# Altium schematic sheet Single_Amplifier(Filter)2.0.SchDoc
size A2; Organization: Altium Limited; Address1: L3, 12a Rodborough Rd; Address2: Frenchs Forest; Address3: NSW; Address4: Australia 2086
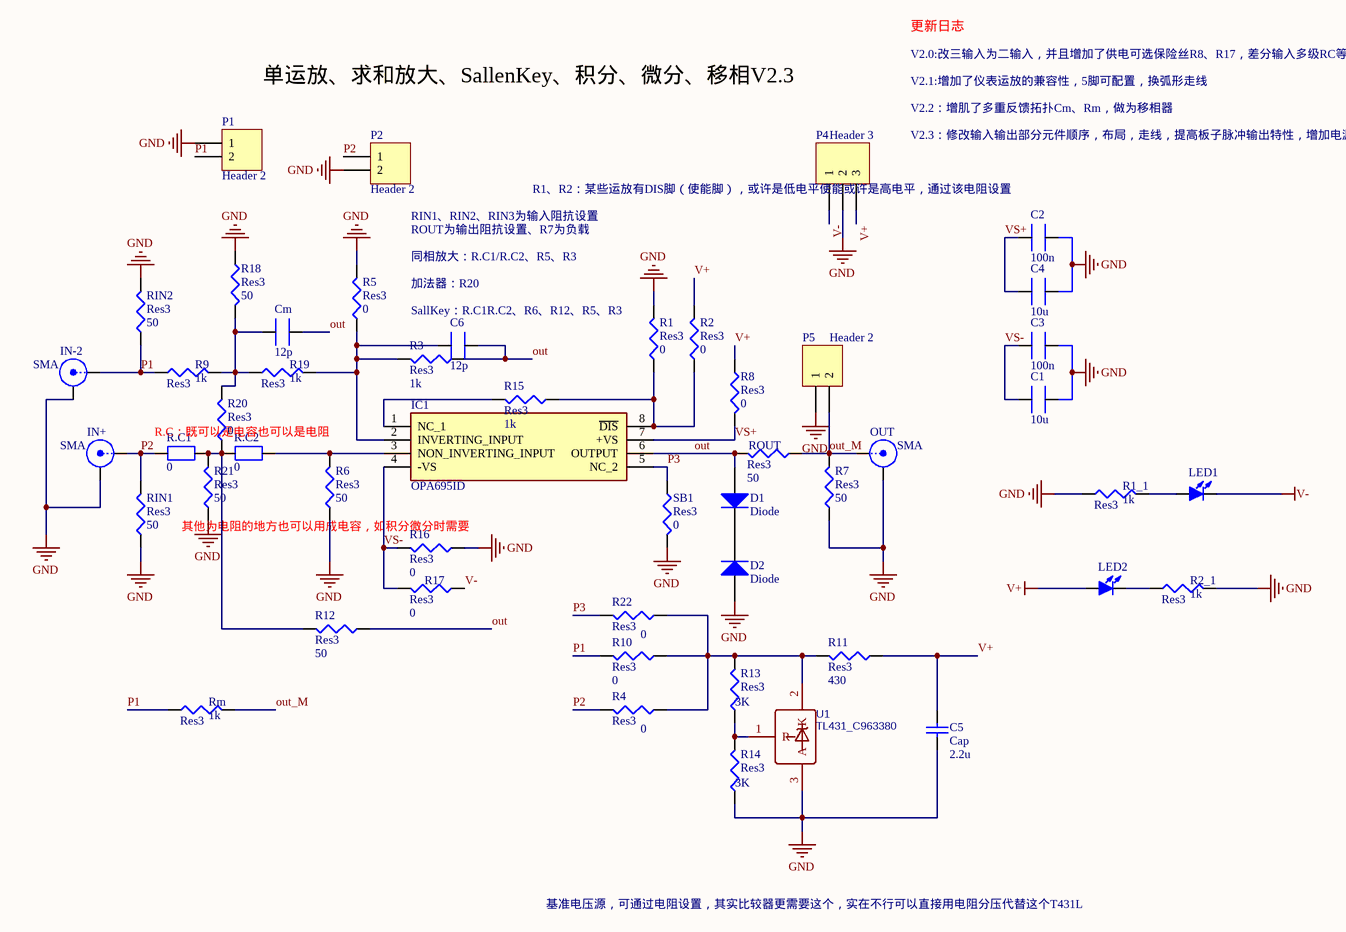
[diagram p0: Single_Amplifier(Filter)2.0.SchDoc]

## Parts
C1  10u  [0805D]
C2  100n  [0805D]
C3  100n  [0805D]
C4  10u  [0805D]
C5  Cap  value 2.2u  [0805D]
C6  12p  [0805D]
Cm  12p  [0805D]
D1  Diode  [1206A]
D2  Diode  [1206A]
IC1  OPA695ID  [SOIC127P600X175-8N]
IN+  SMA  [SMA1]
IN-2  SMA  [SMA1]
LED1  (no value)  [0805D]
LED2  (no value)  [0805D]
OUT  SMA  [SMA1]
P1  Header 2  [HDR1X2]
P2  Header 2  [HDR1X2]
P4  Header 3  [HDR1X3]
P5  Header 2  [HDR1X2]
R1  Res3  value 0  [0805D]
R1_1  Res3  value 1k  [0805D]
R2  Res3  value 0  [0805D]
R2_1  Res3  value 1k  [0805D]
R3  Res3  value 1k  [0805D]
R4  Res3  value 0  [0805D]
R5  Res3  value 0  [0805D]
R6  Res3  value 50  [0805D]
R7  Res3  value 50  [0805D]
R8  Res3  value 0  [0805D]
R9  Res3  value 1k  [0805D]
R10  Res3  value 0  [0805D]
R11  Res3  value 430  [0805D]
R12  Res3  value 50  [0805D]
R13  Res3  value 3K  [0805D]
R14  Res3  value 3K  [0805D]
R15  Res3  value 1k  [0805D]
R16  Res3  value 0  [0805D]
R17  Res3  value 0  [0805D]
R18  Res3  value 50  [0805D]
R19  Res3  value 1k  [0805D]
R20  Res3  value 0  [0805D]
R21  Res3  value 50  [0805D]
R22  Res3  value 0  [0805D]
R.C1  0  [0805D]
R.C2  0  [0805D]
RIN1  Res3  value 50  [0805D]
RIN2  Res3  value 50  [0805D]
Rm  Res3  value 1k  [0805D]
ROUT  Res3  value 50  [0805D]
SB1  Res3  value 0  [0805D]
U1  TL431_C963380  [SOT-23]

## Nets
GND: C1.2(SD) C2.2(SD) C3.2(SD) C4.2(SD) C5.1 D2.1(A) IN+.2(Y) IN-2.2(Y) OUT.2(Y) P1.1 P2.2 P4.2 P5.1 R1.2 R1_1.1 R2_1.2 R5.2 R6.1 R7.1 R14.1 R16.1 R18.1 R21.1 RIN1.1 RIN2.2 SB1.2 U1.3(A)
V+: C5.2 LED2.1(A) P4.3 R2.2 R8.1 R11.1
V-: LED1.2(K) P4.1 R17.1
out: C6.2(SD) Cm.2(SD) D1.1(A) IC1.6(OUTPUT) R3.1 R12.1 ROUT.2
out_M: OUT.1(X) P5.2 R7.2 Rm.2 ROUT.1
P1: IN-2.1(X) P1.2 R9.1 R10.2 RIN2.1 Rm.1
P2: IN+.1(X) P2.1 R4.2 R.C1.1(SD) RIN1.2
P3: IC1.5(NC_2) R22.2 SB1.1
VS+: C2.1(SD) C4.1(SD) IC1.7(+VS) R8.2
VS-: C1.1(SD) C3.1(SD) IC1.4(-VS) R16.2 R17.2
NetC6_1: C6.1(SD) IC1.2(INVERTING_INPUT) R3.2 R5.1 R19.2
NetCm_1: Cm.1(SD) R9.2 R18.2 R19.1 R20.2
NetD1_2: D1.2(K) D2.2(K)
NetIC1_1: IC1.1(NC_1) R15.2
NetIC1_3: IC1.3(NON_INVERTING_INPUT) R6.2 R.C2.2(SD)
NetIC1_8: IC1.8(~{DIS}) R1.1 R2.1 R15.1
NetLED1_1: LED1.1(A) R1_1.2
NetLED2_2: LED2.2(K) R2_1.1
NetR4_1: R4.1 R10.1 R11.2 R13.2 R22.1 U1.2(K)
NetR12_2: R12.2 R20.1 R21.2 R.C1.2(SD) R.C2.1(SD)
NetR13_1: R13.1 R14.2 U1.1(R)

## Notes on the sheet
- V2.0:改三输入为二输入，并且增加了供电可选保险丝R8、R17，差分输入多级RC等
- 更新日志
- 单运放、求和放大、SallenKey、积分、微分、移相V2.3
- V2.1:增加了仪表运放的兼容性，5脚可配置，换弧形走线
- V2.2：增肌了多重反馈拓扑Cm、Rm，做为移相器
- (near P4) R1、R2：某些运放有DIS脚（使能脚），或许是低电平使能或许是高电平，通过该电阻设置
- V2.3：修改输入输出部分元件顺序，布局，走线，提高板子脉冲输出特性，增加电源指示灯
- RIN1、RIN2、RIN3为输入阻抗设置
- 同相放大：R.C1/R.C2、R5、R3
- ROUT为输出阻抗设置、R7为负载
- SallKey：R.C1R.C2、R6、R12、R5、R3
- 加法器：R20
- (near R20) R.C：既可以是电容也可以是电阻
- 其他为电阻的地方也可以用成电容，如积分微分时需要
- 基准电压源，可通过电阻设置，其实比较器更需要这个，实在不行可以直接用电阻分压代替这个T431L
- Title
- Size:
- Date:
- File:
- A2
- Number:
- Time:
- Revision:
- Sheet
- of

## Library data of the parts
C1-C4 C6 Cm = CAP_T
C5 = Cap: Capacitor; Published: 8-Jun-2000; LatestRevisionDate: 17-Jul-2002; LatestRevisionNote: Re-released for DXP Platform.; PackageReference: RAD-0.3; Publisher: Altium Limited; PackageDescription: Radial Cap, Thru-Hole; 2 Leads; 0.3 in Pin Spacing
D1 D2 = Diode: Default Diode; Published: 8-Jun-2000; LatestRevisionDate: 17-Jul-2002; LatestRevisionNote: Re-released for DXP Platform.; PackageVersion: Sep-1996; PackageReference: SMC; Publisher: Altium Limited; PackageDescription: DO-214-AB/SMC; 2 C-Bend Leads; Body 7.9 x 5.9 mm, inc. leads (LxW); Code_JEDEC: DO-214-AB
IC1 = OPA695ID: Integrated Circuit; Manufacturer_Name: Texas Instruments; Datasheet Link: http://www.ti.com/lit/ds/symlink/opa695.pdf; Height: 1.75mm; Manufacturer_Part_Number: OPA695ID; Mouser Part Number: 595-OPA695ID; Mouser Price/Stock: https://www.mouser.co.uk/ProductDetail/Texas-Instruments/OPA695ID/?qs=wgAEGBTxy7n%252BTWPkkfsFRg%3D%3D; Arrow Part Number: OPA695ID; Arrow Price/Stock: https://www.arrow.com/en/products/opa695id/texas-instruments
IN+ IN-2 OUT = BNC: BNC Elbow Connector; LatestRevisionDate: 17-Jul-2002; LatestRevisionNote: Re-released for DXP Platform.; Publisher: Altium Limited
LED1 LED2 = LED-SMD: 贴片LED; 版权归属: 源创客; BOM名称: 贴片LED; 学习资源: www.ooocke.com
P1 P2 P5 = Header 2: Header, 2-Pin; LatestRevisionDate: 17-Jul-2002; LatestRevisionNote: Re-released for DXP Platform.; Publisher: Altium Limited
P4 = Header 3: Header, 3-Pin; LatestRevisionDate: 17-Jul-2002; LatestRevisionNote: Re-released for DXP Platform.; Publisher: Altium Limited
R1 R1_1 R2 R2_1 R3-R22 RIN1 RIN2 Rm ROUT SB1 = Res3: Resistor; Published: 8-Jun-2000; LatestRevisionDate: 29-May-2009; LatestRevisionNote: IPC-7351 Footprint Added.; PackageReference: J1-0603; Publisher: Altium Limited; PackageDescription: Chip Resistor
R.C1 R.C2 = RES_T
U1 = TL431: pin to pad: 1>B 2>E 3>C; BOM_Manufacturer: JSMSEMI; Contributor: LCSC; BOM_Supplier: LCSC; BOM_Supplier Part: C963380; BOM_Manufacturer Part: TL431; spicePre: U; spiceSymbolName: TL431_C963380